# EAGLE schematic IRReceiver (EAGLE 6.6.0)
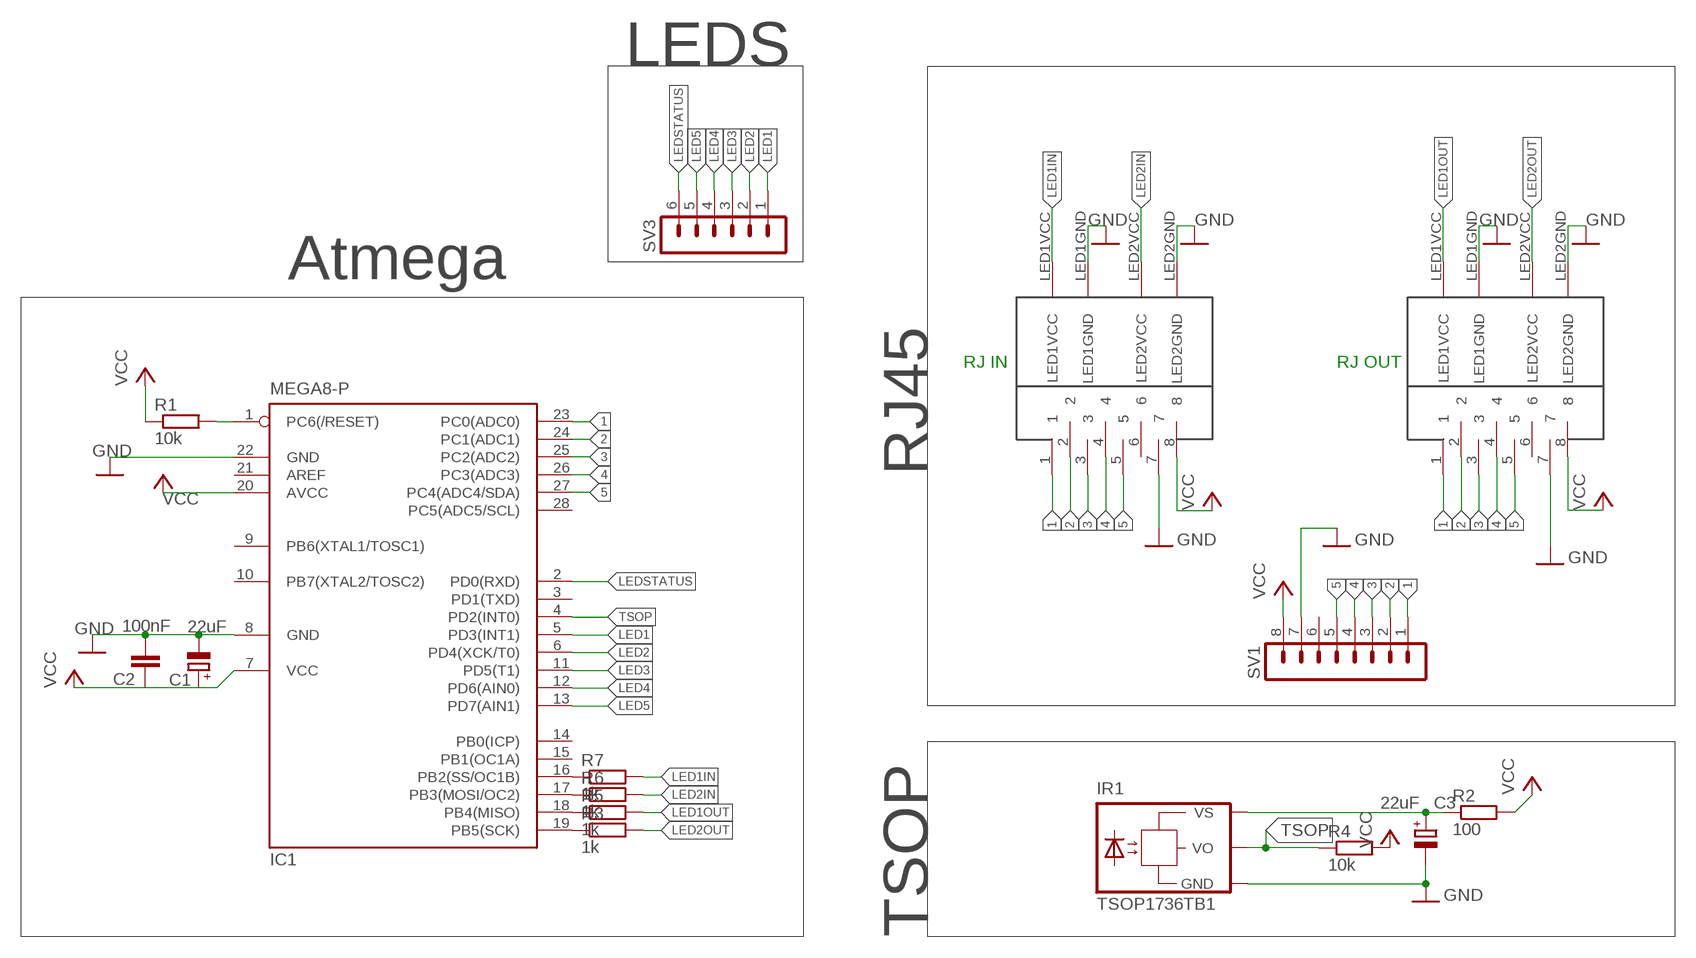
[diagram p0: schematic, sheet 1]

## Parts
C1  22uF  CPOL-EUE5-5  [E5-5]
C2  100nF  C-EUC0805  [C0805]
C3  22uF  CPOL-EUE5-5  [E5-5]
IC1  MEGA8-P  [DIL28-3]
IR1  TSOP1736TB1  [TSOP17_TB1]
R1  10k  R-EU_R0805  [R0805]
R2  100  R-EU_R0805  [R0805]
R3  1k  R-EU_R0805  [R0805]
R4  10k  R-EU_R0805  [R0805]
R5  1k  R-EU_R0805  [R0805]
R6  1k  R-EU_R0805  [R0805]
R7  1k  R-EU_R0805  [R0805]
RJIN  8P8CLED  [8P8CLED]
RJIN1  8P8CLED  [8P8CLED]
SV1  MA08-1  [MA08-1]
SV3  MA06-1  [MA06-1]

## Nets
1: IC1.23(PC0(ADC0)) RJIN1.1 RJIN.1 SV1.1
2: IC1.24(PC1(ADC1)) RJIN1.2 RJIN.2 SV1.2
3: IC1.25(PC2(ADC2)) RJIN1.3 RJIN.3 SV1.3
4: IC1.26(PC3(ADC3)) RJIN1.4 RJIN.4 SV1.4
5: IC1.27(PC4(ADC4/SDA)) RJIN1.5 RJIN.5 SV1.5
GND: C1.- C2.2 C3.- IC1.8(GND) IC1.22(GND) IR1.GND RJIN1.7 RJIN1.LED1GND RJIN1.LED2GND RJIN.7 RJIN.LED1GND RJIN.LED2GND SV1.7
LED1: IC1.5(PD3(INT1)) SV3.1
LED1IN: R7.2 RJIN.LED1VCC
LED1OUT: R5.2 RJIN1.LED1VCC
LED2: IC1.6(PD4(XCK/T0)) SV3.2
LED2IN: R6.2 RJIN.LED2VCC
LED2OUT: R3.2 RJIN1.LED2VCC
LED3: IC1.11(PD5(T1)) SV3.3
LED4: IC1.12(PD6(AIN0)) SV3.4
LED5: IC1.13(PD7(AIN1)) SV3.5
LEDSTATUS: IC1.2(PD0(RXD)) SV3.6
N$1: C3.+ IR1.VS R2.1
N$2: IC1.1(PC6(/RESET)) R1.2
N$3: IC1.19(PB5(SCK)) R3.1
N$4: IC1.18(PB4(MISO)) R5.1
N$5: IC1.17(PB3(MOSI/OC2)) R6.1
N$6: IC1.16(PB2(SS/OC1B)) R7.1
TSOP: IC1.4(PD2(INT0)) IR1.VO R4.1
VCC: C1.+ C2.1 IC1.7(VCC) IC1.20(AVCC) R1.1 R2.2 R4.2 RJIN1.8 RJIN.8 SV1.8
Unconnected: IC1.3(PD1(TXD)) IC1.9(PB6(XTAL1/TOSC1)) IC1.10(PB7(XTAL2/TOSC2)) IC1.14(PB0(ICP)) IC1.15(PB1(OC1A)) IC1.21(AREF) IC1.28(PC5(ADC5/SCL)) RJIN1.6 RJIN.6 SV1.6

## Notes on the sheet
- LEDS
- Atmega
- RJ IN | RJ OUT
- RJ45
- TSOP

## Library data of the parts
C1 C3 = rcl:CPOL-EU: POLARIZED CAPACITOR, European symbol
C2 = rcl:C-EU: CAPACITOR, European symbol
IC1 = atmel:MEGA8-P: MICROCONTROLLER 8 Kbytes FLASH, 1 kbytes SRAM, 512 bytes EEPROM, USART, 4-channel 10 bit ADC, 2-channel 8 bit ADC Pin compatible with Atmega48, ATMega88, ATMega168 Source: avr.lbr; OC_FARNELL: unknown; OC_NEWARK: unknown
IR1 = telefunken:TSOP17*TB1: TSOP17..TB1 IR Receiver Modules for Remote Control Systems Source: http://www.vishay.com/docs/82042/82042.pdf; OC_FARNELL: unknown; OC_NEWARK: unknown
R1-R7 = rcl:R-EU_: RESISTOR, European symbol
RJIN RJIN1 = rj45:8P8CLED: RJ45 with 2 leds
SV1 = con-lstb:MA08-1: PIN HEADER; OC_FARNELL: unknown; OC_NEWARK: unknown
SV3 = con-lstb:MA06-1: PIN HEADER; OC_FARNELL: unknown; OC_NEWARK: unknown